# Altium schematic sheet USB PHY.SchDoc: USB PHY
size A4; DocumentNumber: 4; SheetNumber: 4; SheetTotal: 6
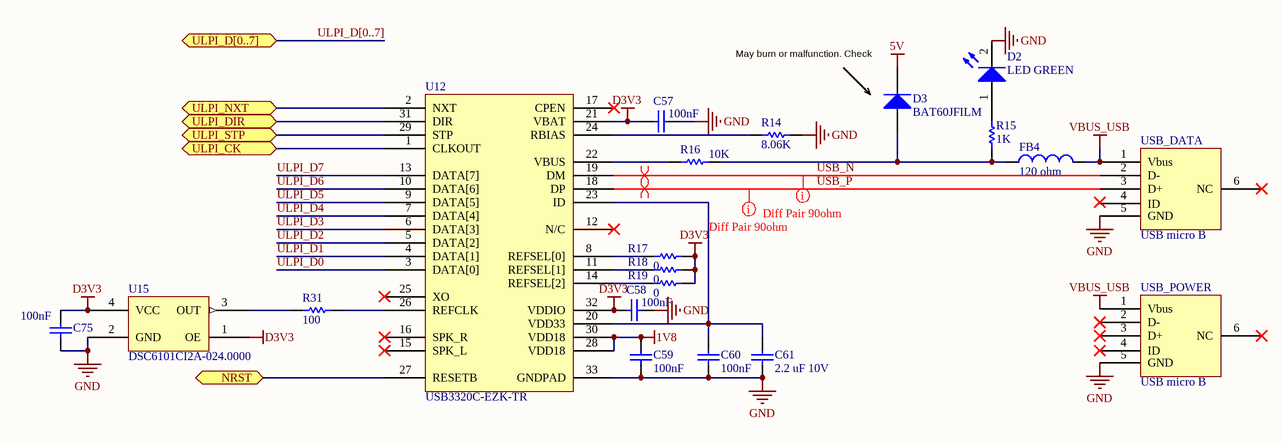
[diagram p0: USB PHY.SchDoc]

## Parts
C57  100nF  [0603 Cap]
C58  100nF  [0603 Cap]
C59  100nF  [0603 Cap]
C60  100nF  [0603 Cap]
C61  2.2 uF 10V  [0603 Cap]
C75  100nF  [0603 Cap]
D2  LED GREEN  [0603 LED]
D3  BAT60JFILM  [SODFL250X117-2N]
FB4  120 ohm  [INDC1608X08L]
R14  8.06K  [0603 Res]
R15  1K  [0603 Res]
R16  10K  [0603 Res]
R17  0  [RESC1005X04L]
R18  0  [RESC1005X04L]
R19  0  [RESC1005X04L]
R31  100  [RESC1005X04L]
U12  USB3320C-EZK-TR  [QFN127P600-8N]
U15  DSC6101CI2A-024.0000  [DFN 3.2x2.5]
USB_DATA  USB micro B  [USB-MicroB]
USB_POWER  USB micro B  [USB-MicroB]

## Ports
NRST (bidir), ULPI_CK (bidir), ULPI_D[0..7] (bidir), ULPI_DIR (bidir), ULPI_NXT (bidir), ULPI_STP (bidir)

## Nets
1V8: C59.2 U12.28(VDD18) U12.30(VDD18)
5V: D3.1(K)
D3V3: C57.2 C58.2 C75.2 R17.2 R18.2 R19.2 U12.21(VBAT) U12.32(VDDIO) U15.1(OE) U15.4(VCC)
GND: C57.1 C58.1 C59.1 C60.1 C61.1 C75.1 D2.2(C) R14.2 U12.33(GNDPAD) U15.2(GND) USB_DATA.5(GND) USB_POWER.5(GND)
VBUS_USB: FB4.2 USB_DATA.1(Vbus) USB_POWER.1(Vbus)
NRST: U12.27(RESETB) ; port NRST
ULPI_CK: U12.1(CLKOUT) ; port ULPI_CK
ULPI_D0: U12.3(DATA[0])
ULPI_D1: U12.4(DATA[1])
ULPI_D2: U12.5(DATA[2])
ULPI_D3: U12.6(DATA[3])
ULPI_D4: U12.7(DATA[4])
ULPI_D5: U12.9(DATA[5])
ULPI_D6: U12.10(DATA[6])
ULPI_D7: U12.13(DATA[7])
ULPI_DIR: U12.31(DIR) ; port ULPI_DIR
ULPI_NXT: U12.2(NXT) ; port ULPI_NXT
ULPI_STP: U12.29(STP) ; port ULPI_STP
USB_N: U12.19(DM) USB_DATA.2(D-)
USB_P: U12.18(DP) USB_DATA.3(D+)
NetC60_2: C60.2 C61.2 U12.20(VDD33) U12.23(ID)
NetD2_1: D2.1(A) R15.2
NetD3_2: D3.2(A) FB4.1 R15.1 R16.2
NetR14_1: R14.1 U12.24(RBIAS)
NetR16_1: R16.1 U12.22(VBUS)
NetR17_1: R17.1 U12.8(REFSEL[0])
NetR18_1: R18.1 U12.11(REFSEL[1])
NetR19_1: R19.1 U12.14(REFSEL[2])
NetR31_1: R31.1 U15.3(OUT)
NetR31_2: R31.2 U12.26(REFCLK)

Not connected (* = marked no-connect by the designer): U12 12(N/C)* 15(SPK_L)* 16(SPK_R)* 17(CPEN)* 25(XO)*; USB_DATA 4(ID) 6(NC)*; USB_POWER 2(D-)* 3(D+)* 4(ID)* 6(NC)*

## Buses and harness runs
bus ULPI_D[0..7] = port ULPI_D[0..7]

## Layout directives
differential pair: USB_N, USB_P
Diff Pair 90ohm: Undefined: USB_N, USB_P

## Notes on the sheet
- (near D3) May burn or malfunction. Check
- Title
- Size:
- A4
- Number:
- Revision:
- Date:
- Sheet
- of

## Library data of the parts
C57-C60 C75 = C0603C104K4RACTU: CAP CER 0.1UF 16V X7R 0603; Manufacturer: KEMET; Capacitance: 0.1µF; Tolerance: ±10%; Supplier 1: Digi-Key; Manufacturer Part Number: C0603C104K4RACTU; RoHS: RoHS Compliant; Category: Capacitors; Stock 1: 4491346; Pricing 1: 1=0.09, 10=0.022, 25=0.016, 50=0.0122, 100=0.01, 250=0.00836, 500=0.0071, 1000=0.00559 (EUR); Packaging: Digi-Reel®; Part Status: Active; Voltage - Rated: 16V; Temperature Coefficient: X7R; Operating Temperature: -55°C ~ 125°C; Features: -; Ratings: -; Applications: General Purpose; Failure Rate: -; Mounting Type: Surface Mount, MLCC; Package / Case: 0603 (1608 Metric); Size / Dimension: 0.063" L x 0.031" W (1.60mm x 0.80mm); Height - Seated (Max): -; Thickness (Max): 0.034" (0.87mm); Lead Spacing: -; Lead Style: -; ComponentLink1URL: http://www.kemet.com/docfinder?Partnumber=C0603C104K4RACTU; ComponentLink1Description: http://www.kemet.com/docfinder?Partnumber=C0603C104K4RACTU; Supplier Part Number 1: 399-1096-6-ND
C61 = CL10B225KP8NNNC: CAP CER 2.2UF 10V X7R 0603; Manufacturer: Samsung Electro-Mechanics America, Inc.; Capacitance: 2.2µF; Tolerance: ±10%; Supplier 1: Digi-Key; Manufacturer Part Number: CL10B225KP8NNNC; RoHS: RoHS Compliant; Category: Capacitors; Stock 1: 226342; Pricing 1: 1=0.15, 10=0.105, 25=0.0764, 50=0.0592, 100=0.0491, 250=0.04068, 500=0.03444, 1000=0.02851 (EUR); Packaging: Digi-Reel®; Part Status: Active; Voltage - Rated: 10V; Temperature Coefficient: X7R; Operating Temperature: -55°C ~ 125°C; Features: -; Ratings: -; Applications: General Purpose; Mounting Type: Surface Mount, MLCC; Package / Case: 0603 (1608 Metric); Size / Dimension: 0.063" L x 0.031" W (1.60mm x 0.80mm); Height - Seated (Max): -; Thickness (Max): 0.035" (0.90mm); Lead Spacing: -; Lead Style: -; ComponentLink1URL: http://www.samsungsem.com/kr/support/product-search/mlcc/__icsFiles/afieldfile/2016/08/18/S_CL10B225KP8NNNC.pdf; ComponentLink1Description: http://www.samsungsem.com/kr/support/product-search/mlcc/__icsFiles/afieldfile/2016/08/18/S_CL10B225KP8NNNC.pdf; Supplier Part Number 1: 1276-1134-6-ND
D2 = LTST-C191KGKT: LED GREEN CLEAR 0603 SMD; Manufacturer: Lite-On Inc.; Lens Color: Colorless; Millicandela Rating: 35mcd; Lens Style/Size: Rectangle with Flat Top, 1.10mm x 0.80mm; Voltage - Forward (Vf) (Typ): 2V; Current - Test: 20mA; Viewing Angle: 130°; Wavelength - Dominant: 571nm; Wavelength - Peak: 574nm; Supplier 1: Digi-Key; Manufacturer Part Number: LTST-C191KGKT; RoHS: RoHS Compliant; Category: Optoelectronics; Stock 1: 1105619; Pricing 1: 1=0.27, 10=0.197, 25=0.1456, 100=0.1039, 250=0.07068, 500=0.06234, 1000=0.04884, 2500=0.0478 (EUR); Packaging: Digi-Reel®; Part Status: Active; Color: Green; Lens Transparency: Clear; Mounting Type: Surface Mount; Features: -; Package / Case: 0603 (1608 Metric); Size / Dimension: 1.60mm L x 0.80mm W; Height (Max): 0.55mm; ComponentLink1URL: http://optoelectronics.liteon.com/upload/download/DS22-2000-228/S_110_LTST-C191KGKT.pdf; ComponentLink1Description: http://optoelectronics.liteon.com/upload/download/DS22-2000-228/S_110_LTST-C191KGKT.pdf; Supplier Part Number 1: 160-1446-6-ND
D3 = BAT60JFILM: DIODE SCHOTTKY 10V 3A SOD323; Manufacturer: STMicroelectronics; Current - Average Rectified (Io): 3A (DC); Voltage - Forward (Vf) (Max) @ If: 580mV @ 1A; Speed: Fast Recovery =< 500ns, > 200mA (Io); Current - Reverse Leakage @ Vr: 6µA @ 10V; Supplier 1: Digi-Key; Manufacturer Part Number: BAT60JFILM; RoHS: RoHS Compliant; Category: Discrete Semiconductor Products; Stock 1: 49087; Pricing 1: 1=0.36, 10=0.272, 100=0.1539, 500=0.10188, 1000=0.07812 (EUR); Packaging: Cut Tape (CT); Part Status: Active; Diode Type: Schottky; Capacitance @ Vr, F: -; Mounting Type: Surface Mount; Package / Case: SC-76, SOD-323; Supplier Device Package: SOD-323; Operating Temperature - Junction: 150°C (Max); ComponentLink1URL: http://www.st.com/content/ccc/resource/technical/document/datasheet/3d/d2/27/1d/20/e3/4d/48/CD00001944.pdf/files/CD00001944.pdf/jcr:content/translations/en.CD00001944.pdf; ComponentLink1Description: http://www.st.com/content/ccc/resource/technical/document/datasheet/3d/d2/27/1d/20/e3/4d/48/CD00001944.pdf/files/CD00001944.pdf/jcr:content/translations/en.CD00001944.pdf; Supplier Part Number 1: 497-3707-1-ND
FB4 = BLM18PG121SN1D: FERRITE BEAD 120 OHM 0603 1LN; Manufacturer: Murata Electronics North America; Filter Type: Power Line; Number of Lines: 1; Impedance @ Frequency: 120 Ohm @ 100MHz; Current Rating (Max): 2A; DC Resistance (DCR) (Max): 50 mOhm; Supplier 1: Digi-Key; Manufacturer Part Number: BLM18PG121SN1D; RoHS: RoHS Compliant; Category: Filters; Stock 1: 1305577; Pricing 1: 1=0.09, 10=0.067, 25=0.06, 50=0.0438, 100=0.038, 250=0.02996, 500=0.0253, 1000=0.02132 (EUR); Packaging: Cut Tape (CT); Part Status: Active; Ratings: -; Operating Temperature: -55°C ~ 125°C; Package / Case: 0603 (1608 Metric); Mounting Type: Surface Mount; Height (Max): 0.037" (0.95mm); Size / Dimension: 0.063" L x 0.031" W (1.60mm x 0.80mm); ComponentLink1URL: http://www.murata.com/en-us/products/productdata/8796738650142/ENFA0003.pdf; ComponentLink1Description: http://www.murata.com/en-us/products/productdata/8796738650142/ENFA0003.pdf; Supplier Part Number 1: 490-1037-1-ND
R14 = RC0603FR-078K06L: RES SMD 8.06K OHM 1% 1/10W 0603; Manufacturer: Yageo; Power (Watts): 0.1W, 1/10W; Temperature Coefficient: ±100ppm/°C; Supplier 1: Digi-Key; Manufacturer Part Number: RC0603FR-078K06L; RoHS: RoHS Compliant; Category: Resistors; Stock 1: 336883; Pricing 1: 1=0.09, 10=0.013, 100=0.0053, 1000=0.00235, 2500=0.00204 (EUR); Packaging: Cut Tape (CT); Part Status: Active; Tolerance: ±1%; Composition: Thick Film; Features: Moisture Resistant; Operating Temperature: -55°C ~ 155°C; Package / Case: 0603 (1608 Metric); Supplier Device Package: 0603; Size / Dimension: 0.063" L x 0.031" W (1.60mm x 0.80mm); Height - Seated (Max): 0.022" (0.55mm); Failure Rate: -; ComponentLink1URL: http://www.yageo.com/documents/recent/PYu-RC_Group_51_RoHS_L_7.pdf; ComponentLink1Description: http://www.yageo.com/documents/recent/PYu-RC_Group_51_RoHS_L_7.pdf; Supplier Part Number 1: 311-8.06KHRCT-ND
R15 = RC0603FR-071KL: RES SMD 1K OHM 1% 1/10W 0603; Manufacturer: Yageo; Power (Watts): 0.1W, 1/10W; Temperature Coefficient: ±100ppm/°C; Supplier 1: Digi-Key; Manufacturer Part Number: RC0603FR-071KL; RoHS: RoHS Compliant; Category: Resistors; Stock 1: 10099217; Pricing 1: 1=0.09, 10=0.012, 25=0.0088, 50=0.0066, 100=0.0049, 250=0.00372, 500=0.00296, 1000=0.00218 (EUR); Packaging: Digi-Reel®; Part Status: Active; Resistance (Ohms): 1k; Tolerance: ±1%; Composition: Thick Film; Features: Moisture Resistant; Operating Temperature: -55°C ~ 155°C; Package / Case: 0603 (1608 Metric); Supplier Device Package: 0603; Size / Dimension: 0.063" L x 0.031" W (1.60mm x 0.80mm); Height - Seated (Max): 0.022" (0.55mm); Failure Rate: -; ComponentLink1URL: http://www.yageo.com/documents/recent/PYu-RC_Group_51_RoHS_L_7.pdf; ComponentLink1Description: http://www.yageo.com/documents/recent/PYu-RC_Group_51_RoHS_L_7.pdf; Supplier Part Number 1: 311-1.00KHRDKR-ND
R16 = RC0603FR-0710KL: RES SMD 10K OHM 1% 1/10W 0603; Manufacturer: Yageo; Power (Watts): 0.1W, 1/10W; Temperature Coefficient: ±100ppm/°C; Supplier 1: Digi-Key; Manufacturer Part Number: RC0603FR-0710KL; RoHS: RoHS Compliant; Category: Resistors; Stock 1: 17023109; Pricing 1: 1=0.09, 10=0.012, 25=0.0088, 50=0.0066, 100=0.0049, 250=0.00372, 500=0.00296, 1000=0.00218 (EUR); Packaging: Cut Tape (CT); Part Status: Active; Resistance (Ohms): 10k; Tolerance: ±1%; Composition: Thick Film; Features: Moisture Resistant; Operating Temperature: -55°C ~ 155°C; Package / Case: 0603 (1608 Metric); Supplier Device Package: 0603; Size / Dimension: 0.063" L x 0.031" W (1.60mm x 0.80mm); Height - Seated (Max): 0.022" (0.55mm); Failure Rate: -; ComponentLink1URL: http://www.yageo.com/documents/recent/PYu-RC_Group_51_RoHS_L_7.pdf; ComponentLink1Description: http://www.yageo.com/documents/recent/PYu-RC_Group_51_RoHS_L_7.pdf; Supplier Part Number 1: 311-10.0KHRCT-ND
R17-R19 = RC1005J000CS: RES 0.0 OHM 1/16W JUMP 0402; Manufacturer: Samsung Electro-Mechanics America, Inc; Resistance (Ohms): 0.0; Tolerance: Jumper; Power (Watts): 0.063W, 1/16W; Supplier 1: Digi-Key; Supplier Part Number 1: 1276-3480-1-ND; Manufacturer Part Number: RC1005J000CS; RoHS: RoHS Compliant; Category: Resistors; Stock 1: 2874816; Pricing 1: 1=0.09, 10=0.01, 25=0.0072, 100=0.0039, 500=0.00238, 1000=0.00174, 2500=0.00151, 5000=0.00125 (EUR); Packaging: Cut Tape (CT); Composition: Thick Film; Features: -; Temperature Coefficient: -; Operating Temperature: -55°C ~ 155°C; Package / Case: 0402 (1005 Metric); Supplier Device Package: 0402 (1005 Metric); Size / Dimension: 0.039" L x 0.020" W (1.00mm x 0.50mm); Height: 0.016" (0.40mm); Number of Terminations: 2; ComponentLink1URL: http://www.samsungsem.com/servlet/FileDownload?filename=productcatalog/pdf/Chip_Resistor.pdf; ComponentLink1Description: http://www.samsungsem.com/servlet/FileDownload?filename=productcatalog/pdf/Chip_Resistor.pdf
R31 = MCR01MRTF1000: RES 100 OHM 1/16W 1% 0402 SMD; Manufacturer: Rohm Semiconductor; Power (Watts): 0.063W, 1/16W; Temperature Coefficient: ±100ppm/°C; Supplier 1: Digi-Key; Supplier Part Number 1: RHM100CDCT-ND; Manufacturer Part Number: MCR01MRTF1000; RoHS: RoHS Compliant; Category: Resistors; Stock 1: 128227; Pricing 1: 1=0.09, 10=0.011, 25=0.008, 100=0.0046, 250=0.00348, 500=0.00278, 1000=0.00205, 5000=0.00147 (EUR); Packaging: Cut Tape (CT); Resistance (Ohms): 100; Tolerance: ±1%; Composition: Thick Film; Features: -; Operating Temperature: -55°C ~ 155°C; Package / Case: 0402 (1005 Metric); Supplier Device Package: 0402 (1005 Metric); Size / Dimension: 0.039" L x 0.020" W (1.00mm x 0.50mm); Height: 0.016" (0.40mm); Number of Terminations: 2; ComponentLink1URL: http://rohmfs.rohm.com/en/products/databook/datasheet/passive/resistor/chip_resistor/mcr_g.pdf; ComponentLink1Description: http://rohmfs.rohm.com/en/products/databook/datasheet/passive/resistor/chip_resistor/mcr_g.pdf
U12 = USB3320C-EZK-TR: IC TXRX USB 2.0 FLEXPWR 32QFN; Manufacturer: Microchip Technology; Protocol: USB 2.0; Number of Drivers/Receivers: 1/1; Duplex: Half; Voltage - Supply: 1.8 V ~ 3.3 V; Supplier 1: Digi-Key; Manufacturer Part Number: USB3320C-EZK-TR; RoHS: RoHS Compliant; Category: Integrated Circuits (ICs); Stock 1: 21726; Pricing 1: 1=1.4, 25=1.166, 100=1.0666 (EUR); Packaging: Cut Tape (CT); Part Status: Active; Type: Transceiver; Data Rate: -; Operating Temperature: -40°C ~ 85°C; Mounting Type: Surface Mount; Package / Case: 32-VFQFN Exposed Pad; Supplier Device Package: 32-QFN (5x5); ComponentLink1URL: http://www.microchip.com/mymicrochip/filehandler.aspx?ddocname=en562261; ComponentLink1Description: http://www.microchip.com/mymicrochip/filehandler.aspx?ddocname=en562261; Supplier Part Number 1: USB3320C-EZK-CT-ND
U15 = DSC6101CI2A-024.0000: ULTRA-LOW POWER,MEMS OSCILLATOR,; Manufacturer: Microchip Technology; Function: Enable/Disable; Output: CMOS; Voltage - Supply: 1.71 V ~ 3.63 V; Frequency Stability: ±25ppm; Current - Supply (Max): 3mA (Typ); Current - Supply (Disable) (Max): 10.5µA; Supplier 1: Digi-Key; Manufacturer Part Number: DSC6101CI2A-024.0000; RoHS: RoHS Compliant; Category: Crystals, Oscillators, Resonators; Stock 1: 812; Pricing 1: 1=0.77, 25=0.6448, 100=0.6205 (EUR); Packaging: Tube; Part Status: Active; Type: MEMS (Silicon); Operating Temperature: -40°C ~ 85°C; Ratings: AEC-Q100; Mounting Type: Surface Mount; Package / Case: 4-SMD, No Lead; Size / Dimension: 0.126" L x 0.098" W (3.20mm x 2.50mm); Height - Seated (Max): 0.035" (0.90mm); ComponentLink1URL: http://www.microchip.com/mymicrochip/filehandler.aspx?ddocname=en587492; ComponentLink1Description: http://www.microchip.com/mymicrochip/filehandler.aspx?ddocname=en587492; Supplier Part Number 1: DSC6101CI2A-024.0000-ND